# EAGLE design v0.6.2 (EAGLE 7.3.0)
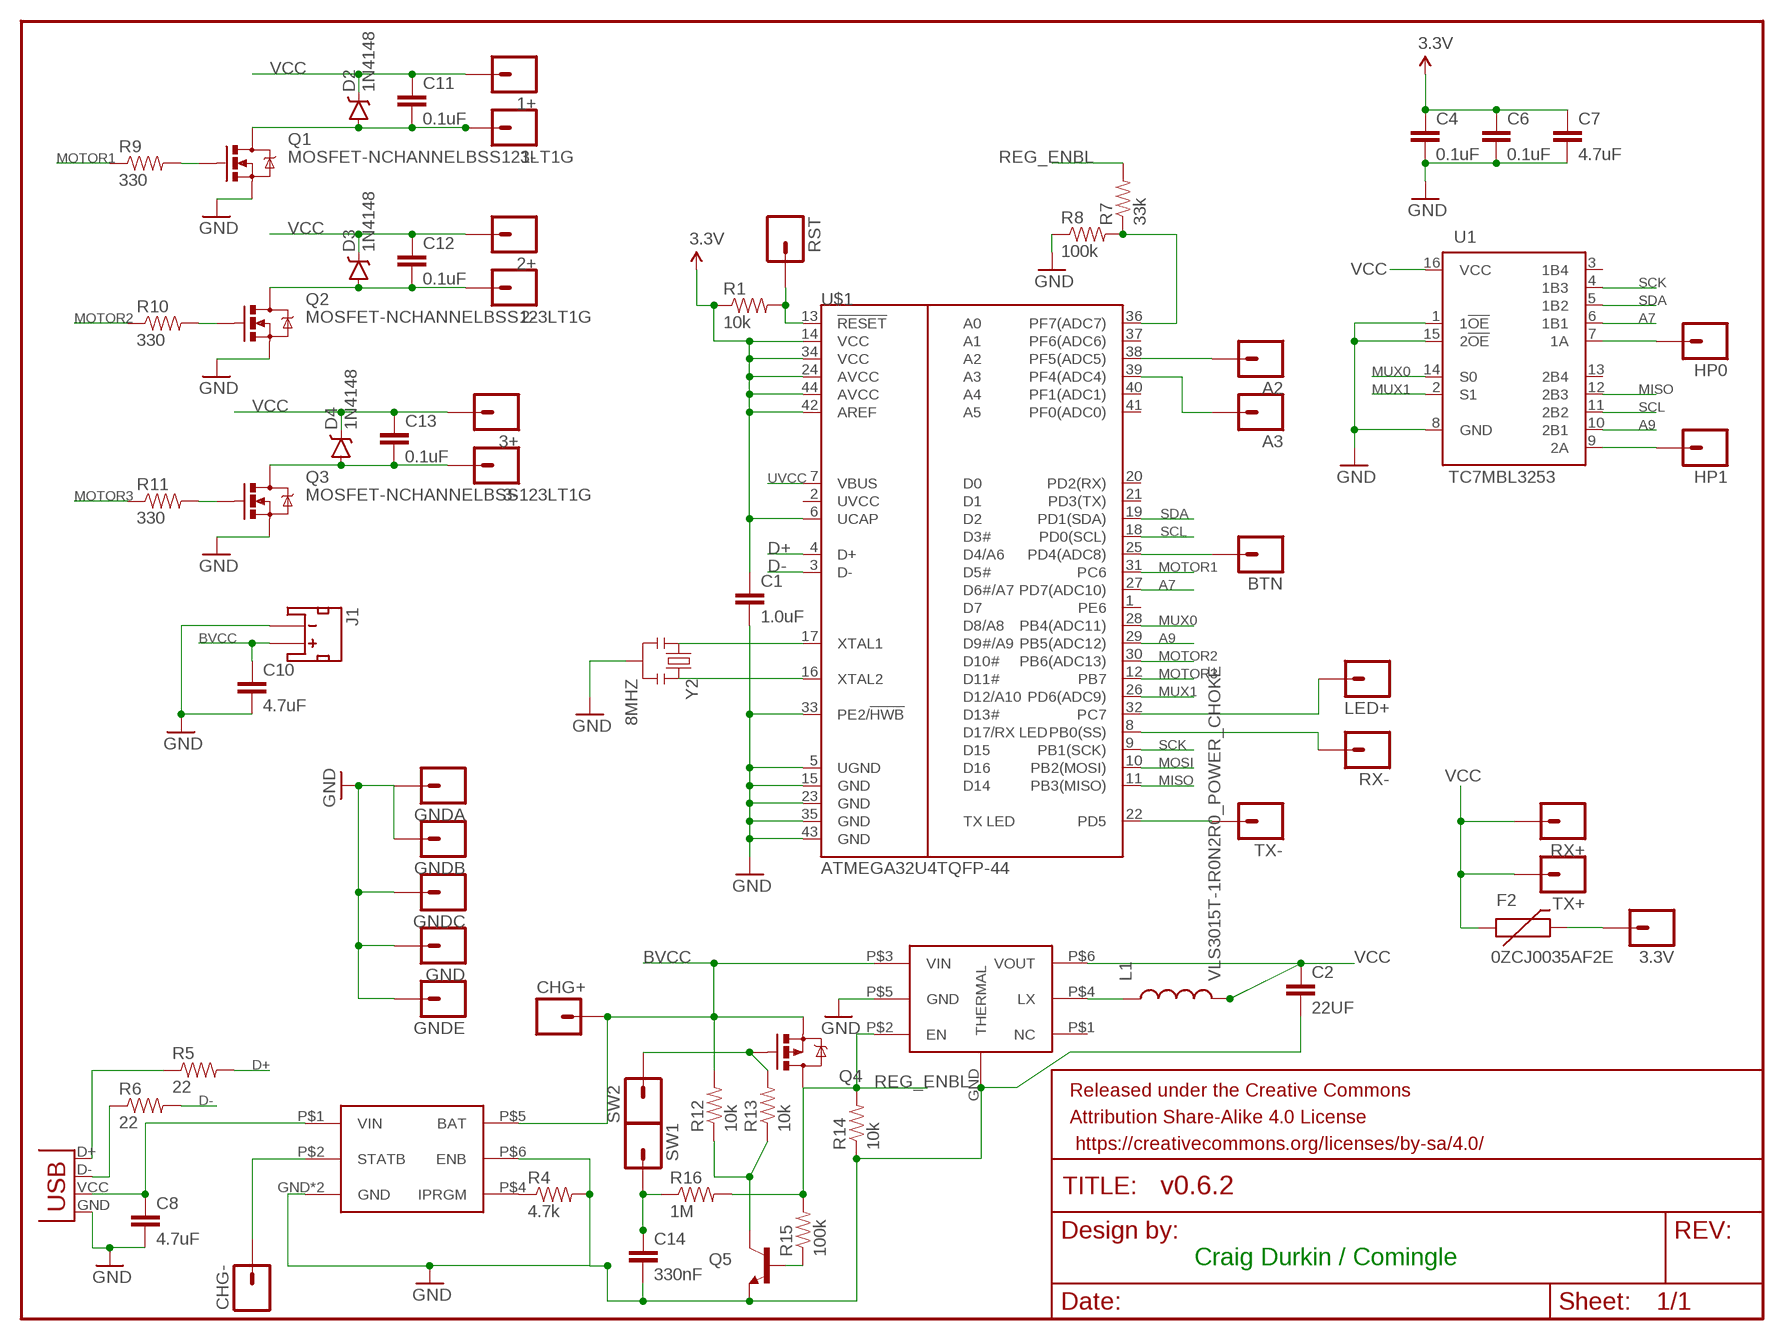
[diagram p0: schematic, sheet 1]

## Parts
1+  M01PTH  [1X01]
1-  M01PTH  [1X01]
2+  M01PTH  [1X01]
2-  M01PTH  [1X01]
3+  M01PTH  [1X01]
3-  M01PTH  [1X01]
3.3V  M01PTH  [1X01]
A2  M01PTH  [1X01]
A3  M01PTH  [1X01]
BTN  M01PTH  [1X01]
C1  1.0uF  CAP0603-CAP  [0603-CAP]
C2  22UF  CAP0805  [0805]
C4  0.1uF  CAP0603-CAP  [0603-CAP]
C6  0.1uF  CAP0603-CAP  [0603-CAP]
C7  4.7uF  CAP0603-CAP  [0603-CAP]
C8  4.7uF  CAP0603-CAP  [0603-CAP]
C10  4.7uF  CAP0603-CAP  [0603-CAP]
C11  0.1uF  CAP0603-CAP  [0603-CAP]
C12  0.1uF  CAP0603-CAP  [0603-CAP]
C13  0.1uF  CAP0603-CAP  [0603-CAP]
C14  330nF  CAP0603-CAP  [0603-CAP]
CHG+  M01PTH  [1X01]
CHG-  M01PTH  [1X01]
D2  1N4148  BAT20JFILM  [SOD-323]
D3  1N4148  BAT20JFILM  [SOD-323]
D4  1N4148  BAT20JFILM  [SOD-323]
F2  0ZCJ0035AF2E  PTCSMD  [PTC-1206]
FRAME1  FRAME-LETTER  [CREATIVE_COMMONS]
GND  M01PTH  [1X01]
GNDA  M01PTH  [1X01]
GNDB  M01PTH  [1X01]
GNDC  M01PTH  [1X01]
GNDE  M01PTH  [1X01]
HP0  M01PTH  [1X01]
HP1  M01PTH  [1X01]
J1  JST_2MM_MALE  [JST-2-SMD]
JP4  USBMICROB-GCT-USB3075  [USB-MICROB-GCT-USB3075]
L1  VLS3015T-1R0N2R0_POWER_CHOKE  [3MM_POWER_CHOKE]
LED+  M01PTH  [1X01]
Q1  MOSFET-NCHANNELBSS123LT1G  [SOT23-3]
Q2  MOSFET-NCHANNELBSS123LT1G  [SOT23-3]
Q3  MOSFET-NCHANNELBSS123LT1G  [SOT23-3]
Q4  NTS2101PT1G  MOSFET-PCHANNELSOT323  [SOT323]
Q5  MMBT2222A  TRANSISTOR_NPNMMBT2222A  [SOT23-3]
R1  10k  RESISTOR0603-RES  [0603-RES]
R4  4.7k  RESISTOR0603-RES  [0603-RES]
R5  22  RESISTOR0603-RES  [0603-RES]
R6  22  RESISTOR0603-RES  [0603-RES]
R7  33k  RESISTOR0603-RES  [0603-RES]
R8  100k  RESISTOR0603-RES  [0603-RES]
R9  330  RESISTOR0603-RES  [0603-RES]
R10  330  RESISTOR0603-RES  [0603-RES]
R11  330  RESISTOR0603-RES  [0603-RES]
R12  10k  RESISTOR0603-RES  [0603-RES]
R13  10k  RESISTOR0603-RES  [0603-RES]
R14  10k  RESISTOR0603-RES  [0603-RES]
R15  100k  RESISTOR0603-RES  [0603-RES]
R16  1M  RESISTOR0603-RES  [0603-RES]
RST  M01PTH  [1X01]
RX+  M01PTH  [1X01]
RX-  M01PTH  [1X01]
SW1  M01PTH  [1X01]
SW2  M01PTH  [1X01]
TX+  M01PTH  [1X01]
TX-  M01PTH  [1X01]
U1  TC7MBL3253  [SSOP16]
U$1  ATMEGA32U4TQFP-44  [TQFP44]
U$3  SC189  [MLPD-UT6]
U$4  SC810  [MLPD-UT6]
Y2  8MHZ  RESONATOR8MHZ  [RESONATOR-SMD]

## Nets
A0: R7.1 R8.2 U$1.36(PF7(ADC7))
A7: U1.6(1B1) U$1.27(PD7(ADC10))
A9: U1.10(2B1) U$1.29(PB5(ADC12))
BVCC: C10.1 CHG+.1 J1.2(+) Q4.2(S) R12.2 U$3.P$3(VIN) U$4.P$5(BAT)
D+: R5.2 U$1.4(D+)
D-: R6.2 U$1.3(D-)
GND: C1.2 C2.2 C4.2 C6.2 C7.2 C8.2 C10.2 C14.2 GND.1 GNDA.1 GNDB.1 GNDC.1 GNDE.1 J1.1(-) JP4.GND Q1.2(S) Q2.2(S) Q3.2(S) Q5.2(E) R4.2 R8.1 R14.1 U1.1(1!OE) U1.8(GND) U1.15(2!OE) U$1.5(UGND) U$1.15(GND) U$1.23(GND) U$1.33(PE2/!HWB) U$1.35(GND) U$1.43(GND) U$3.GND(THERMAL) U$3.P$5(GND) U$4.GND U$4.P$3(GND) U$4.P$6(ENB) Y2.2
MISO: U1.12(2B3) U$1.11(PB3(MISO))
MOSI: U$1.10(PB2(MOSI))
MOTOR1: R9.1 U$1.31(PC6)
MOTOR2: R10.1 U$1.30(PB6(ADC13))
MOTOR3: R11.1 U$1.12(PB7)
MUX0: U1.14(S0) U$1.28(PB4(ADC11))
MUX1: U1.2(S1) U$1.26(PD6(ADC9))
N$1: U$1.17(XTAL1) Y2.1
N$2: CHG-.1 U$4.P$2(STATB)
N$3: Q1.1(G) R9.2
N$4: R4.1 U$4.P$4(IPRGM)
N$5: 3.3V.1 F2.2
N$6: U$1.16(XTAL2) Y2.3
N$7: LED+.1 U$1.32(PC7)
N$8: RX-.1 U$1.8(PB0(SS))
N$9: TX-.1 U$1.22(PD5)
N$10: JP4.D+ R5.1
N$11: JP4.D- R6.1
N$12: L1.1 U$3.P$4(LX)
N$13: HP1.1 U1.9(2A)
N$14: HP0.1 U1.7(1A)
N$15: A2.1 U$1.38(PF5(ADC5))
N$16: A3.1 U$1.39(PF4(ADC4))
N$17: BTN.1 U$1.25(PD4(ADC8))
N$18: Q2.1(G) R10.2
N$20: Q5.3(C) R12.1 R13.1
N$21: C14.1 R16.1 SW1.1
N$22: Q3.1(G) R11.2
N$23: Q4.1(G) R13.2 SW2.1
N$24: 1-.1 C11.2 D2.A Q1.3(D)
N$25: 2-.1 C12.2 D3.A Q2.3(D)
N$26: 3-.1 C13.2 D4.A Q3.3(D)
N$30: Q5.1(B) R15.1
REG_ENBL: Q4.3(D) R7.2 R14.2 R15.2 R16.2 U$3.P$2(EN)
RST: R1.2 RST.1 U$1.13(!RESET)
SCK: U1.4(1B3) U$1.9(PB1(SCK))
SCL: U1.11(2B2) U$1.18(PD0(SCL))
SDA: U1.5(1B2) U$1.19(PD1(SDA))
UVCC: C8.1 JP4.VCC(VBUS) U$1.7(VBUS) U$4.P$1(VIN)
VCC: 1+.1 2+.1 3+.1 C1.1 C2.1 C4.1 C6.1 C7.1 C11.1 C12.1 C13.1 D2.C D3.C D4.C F2.1 L1.2 R1.1 RX+.1 TX+.1 U1.16(VCC) U$1.6(UCAP) U$1.14(VCC) U$1.24(AVCC) U$1.34(VCC) U$1.42(AREF) U$1.44(AVCC) U$3.P$6(VOUT) ; supply symbol labelled 3.3V
Unconnected: J1.NC1(PAD1) J1.NC2(PAD2) U1.3(1B4) U1.13(2B4) U$1.1(PE6) U$1.2(UVCC) U$1.20(PD2(RX)) U$1.21(PD3(TX)) U$1.37(PF6(ADC6)) U$1.40(PF1(ADC1)) U$1.41(PF0(ADC0)) U$3.P$1(NC)

## Notes on the sheet
- Craig Durkin / Comingle

## Library data of the parts
1+ 1- 2+ 2- 3+ 3- 3.3V A2 A3 BTN CHG+ CHG- GND GNDA GNDB GNDC GNDE HP0 HP1 LED+ RST RX+ RX- SW1 SW2 TX+ TX- = SparkFun-Connectors:M01: Header 1 Standard 1-pin 0.1" header. Use with straight break away headers (SKU : PRT-00116), right angle break away headers (PRT-00553), swiss pins (PRT-00743), machine pins (PRT-00117), and female headers (PRT-00115).
C1 C11-C14 = SparkFun-Capacitors:CAP: Capacitor Standard 0603 ceramic capacitor, and 0.1" leaded capacitor.
C2 = v0.4.6:CAP: Capacitor Standard 0603 ceramic capacitor, and 0.1" leaded capacitor.
C4 C6-C8 C10 = SparkFun-Passives:CAP: Capacitor Standard 0603 ceramic capacitor, and 0.1" leaded capacitor.
D2-D4 = SparkFun-DiscreteSemi:BAT20JFILM: 23V, 1A Schottky diode, SOD-323 package; PROD_ID: DIO-11623; VALUE: BAT20JFILM
F2 = SparkFun-PowerIC:PTC: Resettable Fuse PTC Resettable Fuse. Spark Fun Electronics SKU : COM-08357; PROD_ID: RES-11150
FRAME1 = SparkFun-Aesthetics:FRAME-LETTER: Schematic Frame Standard 8.5x11 US Letter frame
J1 = SparkFun-Connectors:JST_2MM_MALE: Mates to single-cell LiPo batteries. CONN-08352; PROD_ID: CONN-08352
JP4 = SparkFun-Connectors:USB: USB Connectors USB-B-PTH is fully proven SKU : PRT-00139/CONN-08278 USB-miniB is fully proven SKU : PRT-00587 USB-A-PCB is untested. USB-A-H is throughly reviewed, but untested. Spark Fun Electronics SKU : PRT-00437 USB-B-SMT is throughly reviewed, but untested. Needs silkscreen touching up. USB-A-S has not been used/tested USB-MB-H has not been used/tested USB-MICROB has been used. CONN-09505
L1 = v0.4.6:VLS3015T-1R0N2R0_POWER_CHOKE
Q1-Q3 = SparkFun-DiscreteSemi:MOSFET-NCHANNEL: Common NMOSFET Parts MFG P/N Store ID Prod ID FDD8780 TRANS-09984 SI7820DN TRANS-11055 FDS6630A IC-08089 2N7002PW TRANS-11151 FQP30N06L COM-10213 TRANS-10060 BSS123LT1G TRANS-08345 BSS138 TRANS-00830 BS170 2N7000; PROD_ID: TRANS-08345
Q4 = SparkFun-DiscreteSemi:MOSFET-PCHANNEL: Generic PMOSFET IRLML2244 - TRANS-11153 (SOT-23 -20V -4.3A) (1.Gate 2.Source 3.Drain) FQP27P06 - COM-10349 <http://www.sparkfun.com/products/10349> (TO-220 -60V -27A) (1.Gate 2.Source 3.Drain)
Q5 = SparkFun-DiscreteSemi:TRANSISTOR_NPN: Generic NPN BJT MMBT2222A - TRANS-08049 (SOT-23, 1A 40V) MPSA42 - TRANS-09116 (SOT-23, 500mA 300V) MMBT5088LT1G - TRANS-11160 (SOT-23, 50 mA 30V) BC547 - COM-08928 <http://www.sparkfun.com/products/8928> (TO-92 45V 100mA) (1.Collector 2.Base 3.Emitter) 2N3904 - COM-00521 <http://www.sparkfun.com/products/521> (TO-92 40V 200mA) (1.Emitter 2.Base 3.Collector) P2N2222A - COM-12852 <http://www.sparkfun.com/products/12852> (TO-92 40V 600mA) (1.Collector 2.Base 3.Emitter); PROD_ID: TRANS-08049
R1 R4-R16 = SparkFun-Passives:RESISTOR: Resistor Basic schematic elements and footprints for 0603, 1206, and PTH resistors.
U1 = comingle:TC7MBL3253
U$1 = SparkFun-DigitalIC:ATMEGA32U4: Atmel 44-pin 8-bit Microcontroller with 32KBytes of ISP Flash and USB Controller
U$3 = comingle:SC189
U$4 = comingle:SC810
Y2 = SparkFun-FreqCtrl:RESONATOR: Resonator Small SMD resonator. Used, eg, on the Arduino Pro/ Pro Mini boards. 8MHz- XTAL-08895 16MHz- XTAL-08900; PROD_ID: XTAL-08895

## Net classes
0 default: width 0.254 mm, drill 0.051 mm, clearance 0.254 mm

## Board
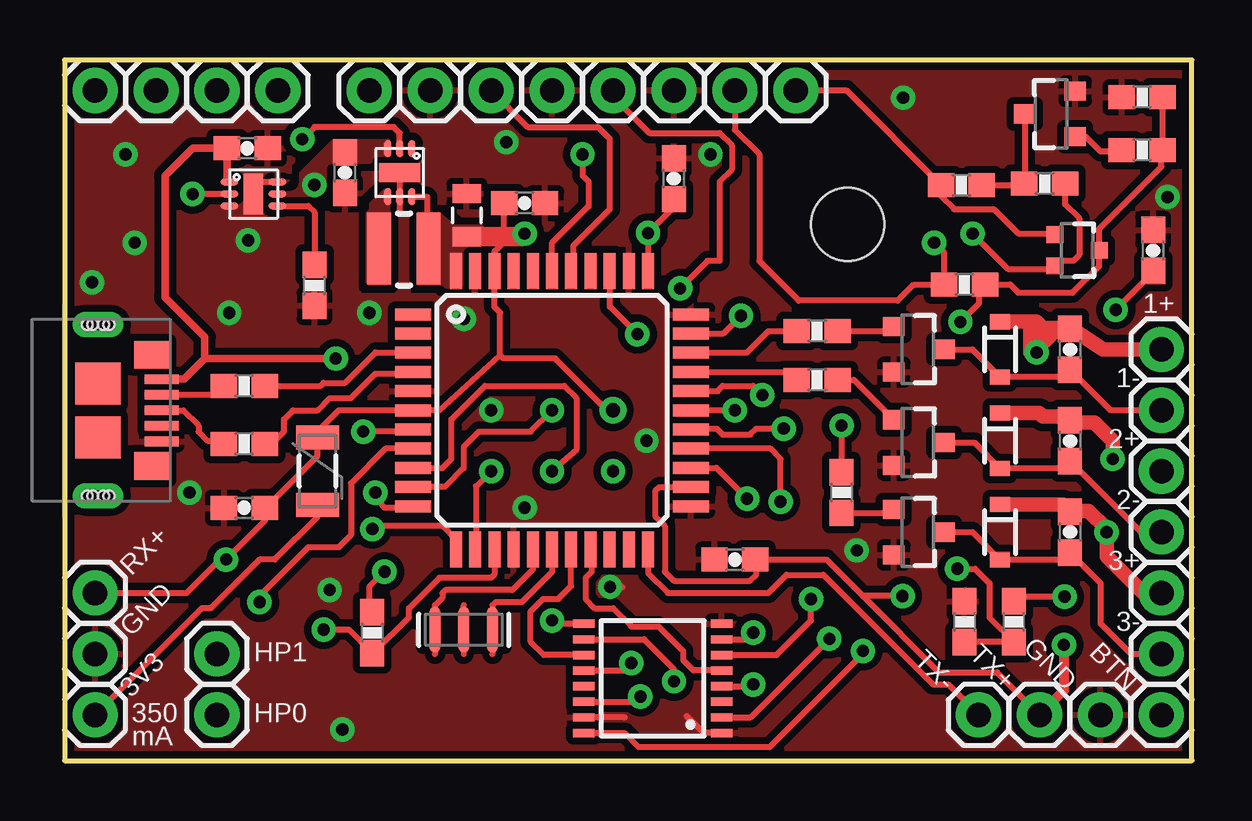
[diagram p1: board, top side]
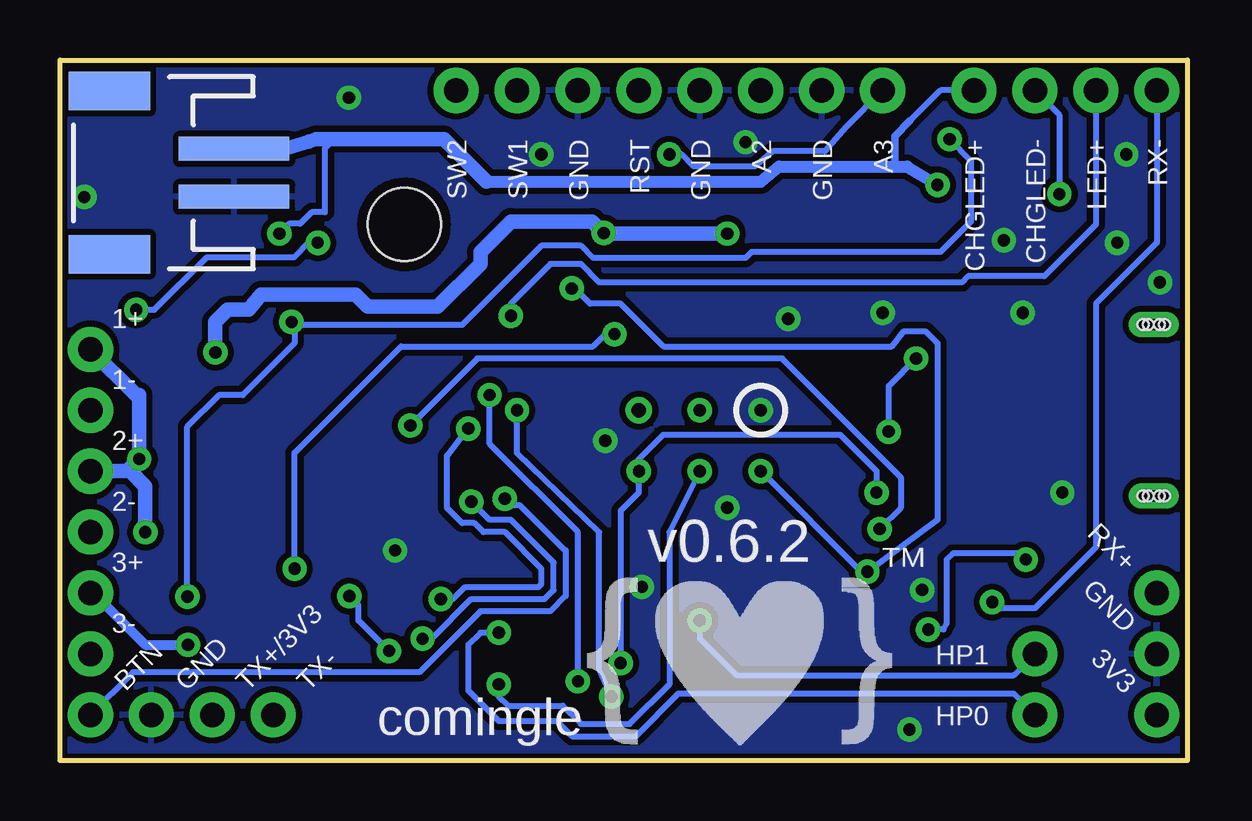
[diagram p2: board, bottom side, seen from below]

Size 46.99 x 29.21 mm. Coordinates in mm from the lower left corner, seen from the top.
Outline: 0,0 46.99,0 46.99,29.21 0,29.21 0,0
Copper layers (1*16): Top 0.035mm / dielectric 1.5mm / Bottom 0.035mm
Design rules "SparkFun-2-layer": minimum track width 7mil, minimum drill 15mil, track to track 8mil, track to pad 8mil, pad to pad 8mil, via to via 8mil, smd to smd 8mil, copper to edge 8mil, drill to drill 8mil, minimum pad ring 12mil, minimum via ring 10mil, stop-mask expansion 4mil, vias tented up to drill 20mil, thermal gap 10mil

### Footprints (pad centres in the part's own frame; a part is rotated, then mirrored left to right if it is on the bottom)
1X01 = drill 1.016 pad 1.88: 1 0,0
0603-CAP = smd 1.1 x 1: 1 -0.85,0; 2 0.85,0
0805 = smd 0.8 x 1.2: 1 -0.9,0; 2 0.9,0
SOD-323 = smd 0.63 x 0.83: A 1.15,0; C -1.15,0
PTC-1206 = smd 1 x 1.8: 1 -1.4,0; 2 1.4,0
JST-2-SMD = smd 1 x 4.6: 1 -1,-3.7; 2 1,-3.7 | smd 1.6 x 3.4: NC1 -3.4,1.5; NC2 3.4,1.5
USB-MICROB-GCT-USB3075 = smd 0.4 x 1.4: D+ 0,2.65; D- -0.65,2.65; GND 1.3,2.65; ID 0.65,2.65; VCC -1.3,2.65 | smd 1.75 x 1.9: P$1 -1.125,0; P$2 1.125,0 | drill 0.45 pad 1.05 long: P$3 -3.57,0; P$4 3.57,0 | smd 1.15 x 1.45: P$5 -2.32,2.23; P$6 2.32,2.23 | hole 0.45: -3.57,0.225; -3.57,0.45; -3.57,-0.45; -3.57,-0.225; 3.57,0.225; 3.57,0.45; 3.57,-0.45; 3.57,-0.225
3MM_POWER_CHOKE = smd 1 x 3: 1 -0.98,0; 2 1.08,0
SOT23-3 = smd 0.8 x 0.9: 1 -0.95,-1; 2 0.95,-1; 3 0,1.1
SOT323 = smd 0.7 x 0.7: 1 -0.65,-0.925; 2 0.65,-0.925; 3 0,0.925
0603-RES = smd 1.1 x 1: 1 -0.85,0; 2 0.85,0
SSOP16 = smd 0.35 x 0.9: 1 -2.275,-2.875; 2 -1.625,-2.875; 3 -0.975,-2.875; 4 -0.325,-2.875; 5 0.325,-2.875; 6 0.975,-2.875; 7 1.625,-2.875; 8 2.275,-2.875; 9 2.275,2.875; 10 1.625,2.875; 11 0.975,2.875; 12 0.325,2.875; 13 -0.325,2.875; 14 -0.975,2.875; 15 -1.625,2.875; 16 -2.275,2.875
TQFP44 = smd 1.5 x 0.5: 1 -5.8,4; 2 -5.8,3.2; 3 -5.8,2.4; 4 -5.8,1.6; 5 -5.8,0.8; 6 -5.8,0; 7 -5.8,-0.8; 8 -5.8,-1.6; 9 -5.8,-2.4; 10 -5.8,-3.2; 11 -5.8,-4; 23 5.8,-4; 24 5.8,-3.2; 25 5.8,-2.4; 26 5.8,-1.6; 27 5.8,-0.8; 28 5.8,0; 29 5.8,0.8; 30 5.8,1.6; 31 5.8,2.4; 32 5.8,3.2; 33 5.8,4 | smd 0.5 x 1.5: 12 -4,-5.8; 13 -3.2,-5.8; 14 -2.4,-5.8; 15 -1.6,-5.8; 16 -0.8,-5.8; 17 0,-5.8; 18 0.8,-5.8; 19 1.6,-5.8; 20 2.4,-5.8; 21 3.2,-5.8; 22 4,-5.8; 34 4,5.8; 35 3.2,5.8; 36 2.4,5.8; 37 1.6,5.8; 38 0.8,5.8; 39 0,5.8; 40 -0.8,5.8; 41 -1.6,5.8; 42 -2.4,5.8; 43 -3.2,5.8; 44 -4,5.8
STAND-OFF-TIGHT = hole 3.048: 0,0
MLPD-UT6 = smd 1.7 x 0.8: GND 0,0 | smd 0.3 x 0.75: P$1 -0.5,-1; P$2 0,-1; P$3 0.5,-1; P$4 0.5,1; P$5 0,1; P$6 -0.5,1
RESONATOR-SMD = smd 0.45 x 1.905: 1 -1.2,0; 2 0,0; 3 1.2,0

### Placement (x,y rotation side)
1+  45.72,17.14 0 top
1-  45.72,14.61 0 top
2+  45.72,12.06 0 top
2-  45.72,9.53 0 top
3+  45.72,6.99 0 top
3-  45.72,4.45 0 top
3.3V  1.27,1.91 0 top
A2  17.78,27.94 0 top
A3  12.7,27.94 0 top
BTN  45.72,1.91 0 top
C1  7.49,10.54 180 top
C2  16.76,22.73 90 top
C4  27.94,8.38 180 top
C6  25.4,24.26 90 top
C7  19.18,23.24 0 top
C8  7.62,25.53 0 top
C10  11.68,24.51 270 top
C11  41.91,17.14 270 top
C12  41.91,13.34 270 top
C13  41.91,9.53 270 top
C14  45.38,21.27 90 top
CHG+  8.89,27.94 0 top
CHG-  6.35,27.94 0 top
D2  38.99,17.14 270 top
D3  38.99,13.34 270 top
D4  38.99,9.53 270 top
F2  10.54,12.06 270 top
FRAME1  5.08,-10.16 0 top  (outside the outline)
GND  20.32,27.94 0 top
GNDA  1.27,4.45 0 top
GNDB  43.18,1.91 0 top
GNDC  25.4,27.94 0 top
GNDE  15.24,27.94 0 top
HP0  6.35,1.91 0 top
HP1  6.35,4.45 0 top
J1  43.43,24.51 90 bottom
JP4  1.4,14.61 270 top
L1  14.1,21.34 0 top
LED+  3.81,27.94 0 top
Q1  35.56,17.14 270 top
Q2  35.56,13.26 270 top
Q3  35.56,9.53 270 top
Q4  42.2,21.27 270 top
Q5  41.12,26.96 90 top
R1  12.83,5.33 90 top
R4  10.41,19.81 270 top
R5  7.49,13.21 0 top
R6  7.49,15.62 0 top
R7  39.57,5.79 90 top
R8  37.52,5.79 270 top
R9  31.37,17.91 0 top
R10  31.37,15.88 0 top
R11  32.38,11.18 270 top
R12  40.85,24.05 0 top
R13  37.38,23.99 180 top
R14  44.91,27.66 0 top
R15  44.91,25.46 0 top
R16  37.51,19.85 0 top
RST  22.86,27.94 0 top
RX+  1.27,6.99 0 top
RX-  1.27,27.94 0 top
SW1  27.94,27.94 0 top
SW2  30.48,27.94 0 top
TX+  40.64,1.91 0 top
TX-  38.1,1.91 0 top
U1  24.51,3.43 90 top
U$1  20.32,14.61 0 top
U$2  [STAND-OFF-TIGHT]  32.64,22.35 0 top
U$3  13.97,24.51 180 top
U$4  7.87,23.62 270 top
Y2  16.64,5.46 180 top

### Tracks (layer width: path | path; a pad name or v marks a point on that pad's centre or on a via)
A0  (via drill 0.51)
  Top 0.254: v23.88,17.78 22.73,18.92 22.73,20.39 U$1.36 | R8.2 R7.1 38.56,5.96 38.56,7.39 37.95,8 v37.21,8
  Bottom 0.254: v37.21,8 37.21,12.83 32.77,17.27 24.77,17.27 24.26,17.78 v23.88,17.78
A7  (via drill 0.51 pad 0.81)
  Top 0.254: U$1.27 26.16,13.84 27.18,13.84 27.43,13.59 28.57,13.59 28.83,13.84 v29.97,13.84 | v31.11,6.73 31.11,5.84 29.68,4.4 U1.6
  Bottom 0.254: v31.11,6.73 30.61,6.73 30.1,7.24 27.05,7.24 26.92,7.37 26.92,8 28.45,9.53 29.34,9.53 29.72,9.91 30.23,9.91 30.86,10.54 30.86,12.7 v29.97,13.84
A9  (via drill 0.51)
  Top 0.254: U$1.29 27.22,15.4 27.43,15.62 28.7,15.62 v29.08,15.24 | U1.10 24.16,5.05 25.4,3.81 v25.4,3.3
  Bottom 0.254: v25.4,3.3 25.4,9.53 29.08,13.21 v29.08,15.24
BVCC  (via drill 0.51, 0.51 pad 0.81)
  Top 0.254: R12.2 41.7,23.2 42.29,22.61 42.29,21.08 42.04,20.83 41.48,20.83 Q4.2 41.15,20.5 39.32,20.5 v37.85,21.97
  Bottom 0.254: 35.56,25.91 35.94,25.53 35.94,22.86 36.5,22.86 36.98,22.38 37.44,22.38 v37.85,21.97 | CHG+.1 10.29,27.94 11.56,26.67 | 39.84,25.4 J1.2
  Bottom 0.305: 11.56,26.67 12.19,26.04 12.19,24.77
  Bottom 0.508: 29.21,24.13 17.78,24.13 17.02,24.77 12.19,24.77 11.68,24.77 v10.41,24
  Bottom 0.61: J1.2 37.58,25.51 36.62,25.81 36.32,25.91 35.56,25.91 30.99,25.91 29.21,24.13
  pour Top (no thermals): 11.18,25.91 13.46,25.91 arc-90 13.59,25.78 13.59,25.27 arc-90 13.46,25.15 12.95,25.15 arc90 12.83,25.02 arc-90 12.7,24.89 11.18,24.89 arc90 10.92,24.64 10.92,24 arc-90 10.41,23.5 8.64,23.5 arc-90 8.51,23.62 arc-90 8.64,23.75 9.4,23.75 arc90 9.78,24.13 9.78,24.51
D+
  Top 0.254: R5.2 8.64,13.21 9.14,13.72 9.14,14.22 9.53,14.61 10.54,14.61 11.05,15.11 11.94,15.11 12.95,16.13 14.44,16.13 U$1.4
D-
  Top 0.254: U$1.3 14.51,17.02 12.95,17.02 11.68,15.75 10.79,15.75 10.67,15.62 R6.2
GND  (via drill 0.51, 0.51 pad 0.81, 0.51 pad 1.02)
  Top 0.254: 23.24,7.24 v22.73,7.24 | 13.97,22.86 U$3.P$5 U$3.GND | U$4.P$6 7.63,24.12 7.62,24.13 7.62,23.88 U$4.GND | U1.1 26.63,1.15 25.93,1.85 | 23.34,1.8 U1.15
  other vias: 5.21,11.18 19.18,10.54 11.58,1.3 17.78,14.61 34.95,27.64 45.97,23.5 26.92,25.27 11.05,7.11 16.64,18.41 24.26,13.34 18.41,25.78 33.02,8.76 2.92,21.59 6.86,18.67 1.14,19.94 2.54,25.27 12.7,18.67 7.65,21.69
  pour Top (isolate 0.305, rank 6): -1.91,-2.03 -1.52,31.11 49.28,30.86 48.77,-1.65
  pour Bottom: -0.89,-1.02 -0.76,30.23 48.39,30.1 47.88,-0.76
MISO  (via drill 0.51, 0.51 pad 0.81)
  Top 0.254: U$1.11 14.46,10.54 13.34,10.54 13.08,10.79 13.08,11.05 v12.95,11.18 | U1.12 23.31,3.75 v23.62,4.06
  Bottom 0.254: v23.62,4.06 23.62,10.41 22.86,11.18 v22.86,12.06 22.86,12.57 21.84,13.59 14.48,13.59 12.95,12.06 v12.95,11.18
MOSI  (via drill 0.51)
  Top 0.254: U$1.10 14.54,11.43 15.88,11.43 16.64,12.19 16.64,13.08 17.27,13.72 19.43,13.72 v20.32,14.61
MOTOR1
  Top 0.254: U$1.31 28.43,17 29.34,17.91 R9.1
MOTOR2
  Top 0.254: U$1.30 30.19,16.2 R10.1
MOTOR3  (via drill 0.51 pad 0.81)
  Top 0.254: v32.38,13.97 R11.1 | U$1.12 16.32,9.21 15.75,9.78 12.95,9.78 v12.83,9.65
  Bottom 0.254: v32.38,13.97 29.59,16.76 16.89,16.76 11.94,11.81 11.94,10.54 v12.83,9.65
MUX0  (via drill 0.51)
  Top 0.254: v27.94,14.61 U$1.28 | U1.14 23.79,2.45 v24,2.67
  Bottom 0.254: v24,2.67 24.51,3.81 24.51,9.53 27.94,12.83 v27.94,14.61
MUX1  (via drill 0.51 pad 0.81)
  Top 0.254: U$1.26 29.41,13.01 29.84,12.57 v29.84,10.79 | U1.2 28.6,1.8 v31.88,5.08
  Bottom 0.254: v31.88,5.08 31.5,5.08 29.84,6.73 26.8,6.73 26.42,7.11 26.42,8.26 28.19,10.03 29.08,10.03 v29.84,10.79
N$1
  Top 0.254: U$1.17 20.32,7.87 19.05,6.6 17.96,6.6 17.84,6.48
N$2  (via drill 0.51)
  Top 0.254: U$4.P$2 v5.33,23.62
  Bottom 0.254: CHG-.1 5.33,26.92 v5.33,23.62
N$3
  Top 0.254: R9.2 34.37,17.91 Q1.1
N$4
  Top 0.254: R4.1 10.41,22.86 10.15,23.12 U$4.P$4
N$5
  Top 0.254: 3.3V.1 5.71,6.35 6.1,6.35 8.13,8.38 8.76,8.38 10.54,10.16 F2.2
N$6
  Top 0.254: U$1.16 19.52,7.96 18.67,7.11 15.88,7.11 15.75,6.99 15.75,6.79 15.44,6.48
N$7  (via drill 0.51)
  Top 0.254: U$1.32 27.46,17.8 v28.19,18.54
  Bottom 0.254: LED+.1 3.81,22.35 5.97,20.19 9.14,20.19 9.4,19.94 24.51,19.94 25.27,20.7 26.54,20.7 28.19,19.05 v28.19,18.54
N$8  (via drill 0.51)
  Top 0.254: U$1.8 13.39,13.01 11.94,11.56 11.94,9.4 11.43,8.89 10.16,8.89 8.13,6.86 v8.13,6.6
  Bottom 0.254: RX-.1 1.27,21.59 3.81,19.05 3.81,8.89 6.35,6.35 7.87,6.35 v8.13,6.6
N$9
  Top 0.254: 38.06,1.94 TX-.1 36.83,3.17 36.2,3.17 31.62,7.75 30.1,7.75 29.34,6.99 25.15,6.99 24.32,7.81 U$1.22
N$10
  Top 0.254: JP4.D+ 4.95,14.61 5.59,13.97 5.59,13.72 5.97,13.34 6.52,13.34 R5.1
N$11
  Top 0.254: JP4.D- 6.28,15.26 R6.1
N$12
  pour Top (no thermals): 13.34,23.88 12.83,23.37 12.7,23.24 12.7,22.99 12.57,22.86 12.57,19.94 12.7,19.81 13.46,19.81 13.59,19.94 13.59,23.88
N$13  (via drill 0.51 pad 0.81)
  Top 0.254: U1.9 20.46,5.7 v20.32,5.84
  Bottom 0.254: v20.32,5.84 20.32,5.08 18.8,3.56 7.24,3.56 HP1.1
N$14  (via drill 0.51 pad 0.81)
  Top 0.254: U1.7 28.42,5.05 v28.7,5.33
  Bottom 0.254: v28.7,5.33 29.46,5.33 29.97,4.83 29.97,2.92 28.7,1.65 26.29,1.65 25.65,1.02 22.99,1.02 21.21,2.79 7.24,2.79 HP0.1
N$15
  Top 0.254: U$1.38 21.21,20.49 21.21,21.46 22.73,22.99 22.73,25.91 22.23,26.42 19.3,26.42 A2.1
N$16  (via drill 0.51 pad 0.81)
  Top 0.254: U$1.39 20.32,21.59 21.84,23.11 21.84,24.13 21.59,24.38 v21.59,25.27
  Bottom 0.254: A3.1 14.22,26.42 15.11,25.4 17.27,25.4 18.03,24.77 20.57,24.77 21.08,25.27 v21.59,25.27
N$17  (via drill 0.51 pad 0.81)
  Top 0.254: U$1.25 27.16,12.21 v28.45,10.92
  Bottom 0.254: BTN.1 43.94,3.68 32,3.68 29.46,6.22 26.54,6.22 25.91,6.86 25.91,8.76 25.93,8.76 27.81,10.64 28.17,10.64 v28.45,10.92
N$18
  Top 0.254: R10.2 32.89,15.88 Q2.1
N$20
  Top 0.254: R13.1 39.94,23.99 R12.1 40.02,24.08 Q5.3
N$21  (via drill 0.51 pad 1.02)
  Top 0.254: SW1.1 27.94,26.29 28.96,25.27 28.96,20.83 30.61,19.18 34.72,19.18 35.38,19.84 36.66,19.84 R16.1 36.66,21.17 v36.25,21.59 | C14.1 45.38,20.36 v43.81,18.8
  Bottom 0.254: v43.81,18.8 43.05,18.8 40.87,20.98 37.24,20.98 36.63,21.59 v36.25,21.59
N$22
  Top 0.254: R11.2 34.41,10.33 Q3.1
N$23
  Top 0.254: Q4.1 41.23,21.97 39.75,21.97 38.73,22.99 37.08,22.99 36.53,23.54 R13.2 32.59,27.94 SW2.1
N$24
  Top 0.254: 1-.1 43.6,14.61 C11.2 41.61,15.99 D2.A 37.84,17.14 Q1.3
N$25
  Top 0.254: 2-.1 44.87,9.53 C12.2 41.61,12.19 D3.A 37.91,13.26 Q2.3
N$26
  Top 0.254: 3-.1 44.45,4.45 43.18,5.71 43.18,7.41 C13.2 41.61,8.38 D4.A 37.84,9.53 Q3.3
N$30
  Top 0.254: Q5.1 42.57,26.01 43.18,25.4 43.99,25.4 44.01,25.4 R15.1
REG_ENBL  (via drill 0.51, 0.51 pad 1.02)
  Top 0.254: R14.2 R15.2 45.72,25.41 45.72,24.77 43.13,22.17 Q4.3 | Q4.3 43.13,21.03 | v9.91,25.91 10.41,26.42 13.72,26.42 13.97,26.16 U$3.P$2 | v41.68,6.83 39.77,6.83 R7.2 | v37.34,18.29 38.11,19.06 38.11,19.8 38.15,19.85 R16.2 39.41,19.85 39.75,19.51 42.01,19.51 43.13,20.62 Q4.3
  Bottom 0.254: 37.21,18.16 30.23,18.16 26.92,21.46 25.27,21.46 24.77,20.95 18.41,20.95 18.16,21.21 10.29,21.21 9.02,22.48 9.02,25.02 v9.91,25.91 | 37.21,18.16 v37.34,18.29 | 37.21,18.16 37.21,17.4 39.37,15.24 40.36,15.24 41.68,13.92 v41.68,6.83
RST  (via drill 0.51, 0.51 pad 0.81)
  Top 0.254: v13.34,7.87 12.7,7.24 12.7,6.31 R1.2 | v17.78,12.06 17.14,11.43 17.14,8.83 U$1.13 | RST.1 22.86,27.69 24.38,26.16 27.3,26.16 27.81,25.65 27.81,24.64 27.3,24.13 27.3,20.83 26.8,20.83 v25.65,19.68
  Bottom 0.254: v17.78,12.06 13.59,7.87 v13.34,7.87 10.41,10.03 10.41,17.4 10.92,17.91 11.81,17.91 12.32,17.27 21.84,17.27 23.62,19.05 24.89,19.05 25.53,19.68 v25.65,19.68
SCK  (via drill 0.51)
  Top 0.254: U$1.9 14.66,12.06 14.79,12.19 15.75,12.19 16.13,12.57 16.13,14.22 17.53,15.62 20.83,15.62 21.34,15.11 21.34,12.95 v20.32,12.06 | U1.4 28.63,3.1 v28.7,3.17
  Bottom 0.254: v20.32,12.06 21.59,9.53 21.59,3.17 23.24,1.52 25.27,1.52 26.04,2.29 28.32,2.29 28.7,2.67 v28.7,3.17
SCL
  Top 0.254: U$1.18 21.12,7.28 20.57,6.73 19.94,6.73 19.43,6.22 19.43,4.95 19.98,4.4 U1.11
SDA
  Top 0.254: U$1.19 21.97,8.75 21.97,7.87 21.72,7.62 21.72,6.73 22.1,6.35 22.86,6.35 23.62,5.59 24.77,5.59 25.78,4.57 25.78,4.19 26.22,3.75 U1.5
UVCC  (via drill 0.51)
  Top 0.254: U$1.7 14.61,13.72 v12.45,13.72 | C8.1 6.48,25.53
  Top 0.305: 5.84,16.76 v11.3,16.76 | 6.35,25.4 6.48,25.53 5.33,25.53 4.19,24.38 4.19,19.3 5.84,17.65 5.84,16.76 | 6.77,24.23 U$4.P$1 6.77,24.12 C8.1 | JP4.VCC 4.98,15.9 5.84,16.76
  Bottom 0.254: 12.32,13.72 v12.45,13.72 12.45,15.62 v11.3,16.76
VCC  (via drill 0.51, 0.51 pad 0.81, 0.6)
  Top 0.254: 18.29,23.28 18.29,21.59 | 24.26,20.34 U$1.34 v24.32,22 25.4,23.07 C6.1 | U$1.24 24.79,11.4 24.64,11.25 24.64,10.16 25.02,9.78 25.02,7.87 25.4,7.49 28.57,7.49 28.83,7.75 28.83,8.34 C4.1 31.75,8.38 33.27,6.86 | U$1.14 17.92,7.76 17.78,7.62 15.62,7.62 14.35,6.35 14.35,5.97 12.87,4.48 R1.1 11.85,5.46 v10.79,5.46 | F2.1 10.54,12.99 | 18.16,16.89 15.62,14.61 U$1.6 11.43,14.61 10.54,13.72 F2.1 | 18.16,16.89 18.16,18.67 17.91,18.92 17.91,20.39 U$1.42 17.91,20.42 17.91,21.21 18.29,21.59 | C2.1 17.01,21.83 17.02,21.84 | 18.29,21.59 18.92,21.59 v19.18,21.97 | v22.86,14.61 22.61,14.61 20.45,16.76 18.29,16.76 18.16,16.89 | RX+.1 5.08,6.99 6.48,8.38 v6.73,8.38 8.34,9.99 C1.1 8.38,10.54 10.54,12.7 F2.1 | 33.27,6.86 36.45,3.68 38.86,3.68 TX+.1 | v34.92,6.86 33.27,6.86 | U$3.P$6 15.1,23.51 15.11,23.5 15.11,21.4 L1.2 | v33.27,4.57 33.27,4.45 29.39,0.56 23.95,0.56 23.36,1.15 U1.16 | 18.29,23.41 18.29,23.28 | 18.29,23.28 C7.1
  Top 0.406: v41.66,4.83 41.66,2.92 TX+.1
  Top 0.61: D4.C 41.61,10.68 C13.1 41.95,10.41 42.67,10.41 43.43,9.65 v43.43,9.53 43.43,8.51 44.96,6.99 3+.1 | D3.C 40.63,14.48 40.77,14.35 41.74,14.35 C12.1 42,14.1 42.93,14.1 43.69,13.34 v43.69,12.57 | D2.C 40.51,18.3 40.77,18.03 | 40.77,18.03 41.4,18.03 | 41.4,18.03 41.87,18.03 C11.1 41.95,18.03 43.31,17.14 1+.1 | 40.26,18.29 40.26,17.02 v40.51,17.02 40.51,17.14 | 40.51,17.14 40.51,17.78 40.77,18.03 | 40.51,17.14 41.4,18.03
  Top 0.813: 17.02,21.84 19.05,21.84 v19.18,21.97
  Bottom 0.254: v33.27,4.57 34.54,5.84 34.54,6.48 v34.92,6.86 | 31.24,18.92 31.37,18.92 | v24.32,22 24.32,21.93 | v10.79,5.46 10.16,5.46 10.03,5.71 10.03,8.38 9.78,8.64 6.99,8.64 v6.73,8.38
  Bottom 0.406: 3+.1 45.59,6.86 45.09,6.86 45.09,6.48 43.43,4.83 v41.66,4.83
  Bottom 0.61: v43.43,9.53 43.43,11.43 44.07,12.06 | 44.07,12.06 2+.1 | 44.07,12.06 44.07,12.19 v43.69,12.57 43.69,15.24 43.81,15.24 1+.1 45.59,17.02 | 31.37,18.92 34.16,18.92 34.67,19.43 38.61,19.43 39.12,18.8 40.01,18.8 40.51,18.29 v40.51,17.02 | v19.18,21.97 24.3,21.97 v24.32,22 24.8,22.48 28.19,22.48 29.46,21.21 29.46,20.7 31.24,18.92
  pour Top (no thermals): 15.62,22.86 16.26,22.35 17.4,22.35 17.53,22.23 17.53,21.59 17.4,21.46 16.89,21.46 16.64,21.21 16.64,19.81 16.51,19.68 15.88,19.68 15.75,19.81 14.73,19.81 14.73,22.86

### Text on the board
tPlace: 1+ | 1- | 2+ | 2- | 3+ | RX+ | 3- | GND | HP1 | 3V3 | TX- | TX+ | GND | BTN | 350 | HP0 | mA
bPlace: RX- | LED+ | CHGLED- | CHGLED+ | A3 | GND | A2 | GND | RST | GND | SW1 | SW2 | 1+ | 1- | 2+ | 2- | RX+ | TM | v0.6.2 | 3+ | GND | HP1 | 3- | 3V3 | comingle | TX- | TX+/3V3 | GND | BTN | HP0